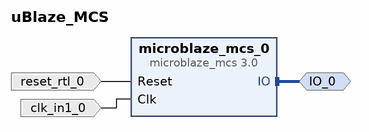
[diagram p0: block diagram of the top level]
# Vivado block design uBlaze_MCS, xc7a35tfgg484-2, Vivado 2018.2
create_bd_design uBlaze_MCS

create_bd_intf_port -mode Master -vlnv xilinx.com:interface:mcsio_bus_rtl:1.0 IO_0
create_bd_port -dir I -type rst reset_rtl_0
set_property -dict {CONFIG.POLARITY ACTIVE_LOW} [get_bd_ports reset_rtl_0]
create_bd_port -dir I -type clk clk_in1_0

create_bd_cell -type ip -vlnv xilinx.com:ip:microblaze_mcs:3.0 microblaze_mcs_0
set_property -dict {CONFIG.MEMSIZE 131072 CONFIG.USE_IO_BUS 1} [get_bd_cells microblaze_mcs_0]

# ---- connections ----

connect_bd_intf_net [get_bd_intf_ports IO_0] [get_bd_intf_pins microblaze_mcs_0/IO]
connect_bd_net -net reset_rtl_0_1 [get_bd_ports reset_rtl_0] [get_bd_pins microblaze_mcs_0/Reset]
connect_bd_net -net clk_in1_0_1 [get_bd_ports clk_in1_0] [get_bd_pins microblaze_mcs_0/Clk]

validate_bd_design
save_bd_design
